# Altium project DesChal1.PrjPCB
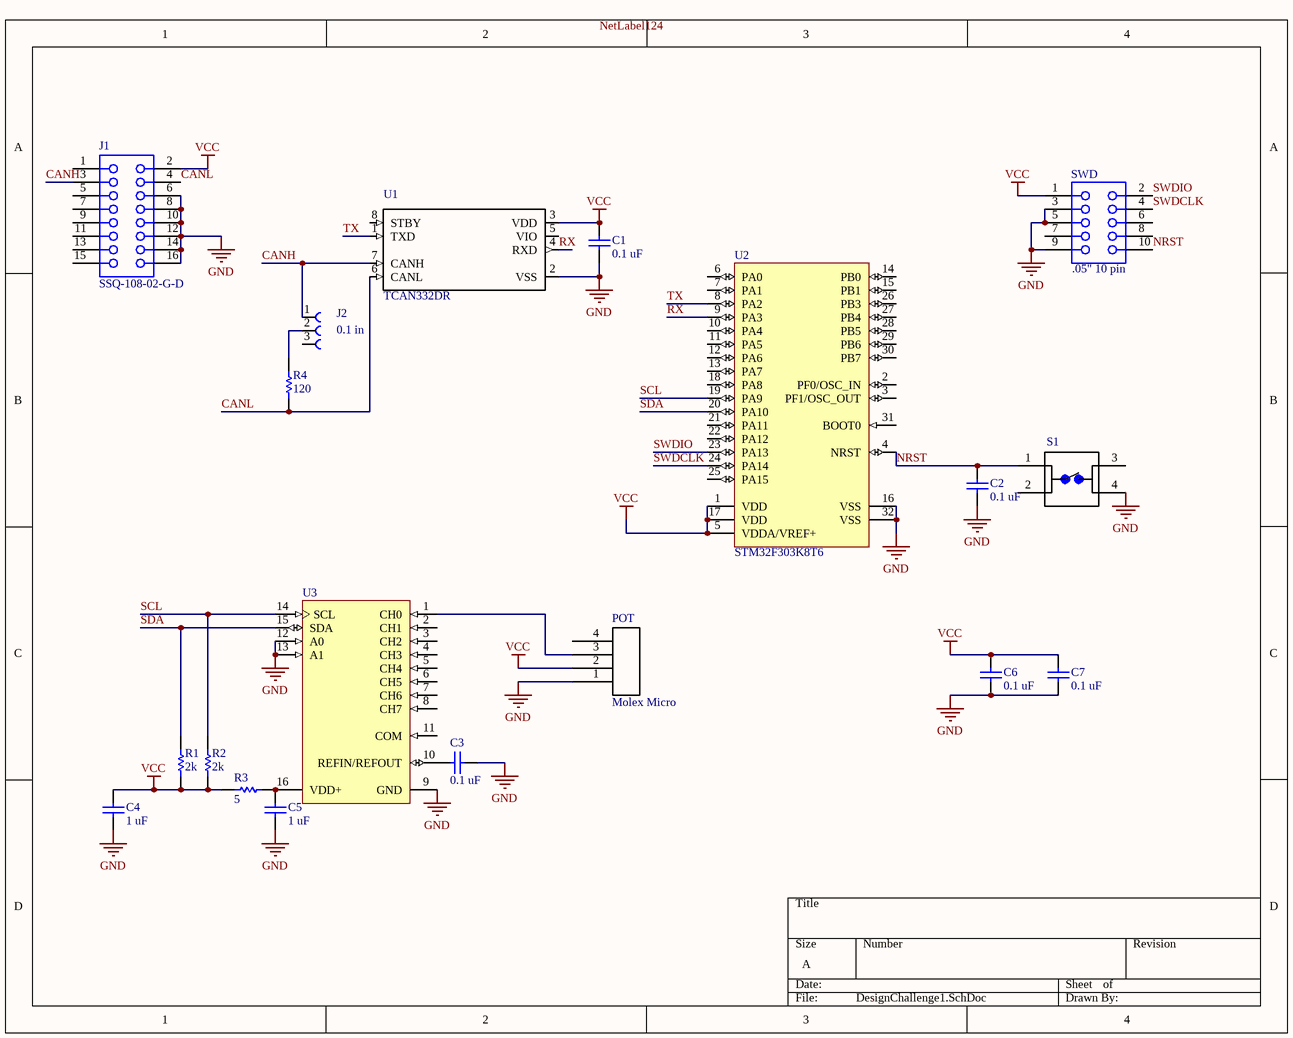
[diagram p0: DesignChallenge1.SchDoc]
1 sheet, 19 parts. Net scope: global (net labels, ports and power ports of the same name join across sheets).

## Sheet DesignChallenge1.SchDoc
size A

### Parts
C1  0.1 uF  [CAPC0805(2012)145_N]
C2  0.1 uF  [CAPC0805(2012)145_N]
C3  0.1 uF  [CAPC0805(2012)145_N]
C4  1 uF  [CAPC0805(2012)145_N]
C5  1 uF  [CAPC0805(2012)145_N]
C6  0.1 uF  [CAPC0805(2012)145_N]
C7  0.1 uF  [CAPC0805(2012)145_N]
J1  SSQ-108-02-G-D  [SMTC-SSQ-108-02-X-D]
J2  0.1 in  [61300311121]
POT  Molex Micro  [0430450427]
R1  2k  [RESC0805(2012)_N]
R2  2k  [RESC0805(2012)_N]
R3  5  [RESC0805(2012)_N]
R4  120  [RESC0805(2012)_N]
S1  1825910-7  [*SW_1825910-7]  (value not drawn)
SWD  .05" 10 pin  [PCE-FH127H432-10-SNGRH-2.4]
U1  TCAN332DR  [Model Name]
U2  STM32F303K8T6  [STM-LQFP32_M]
U3  (no value)  [TI-PW16_M]

### Nets
GND: C1.1 C2.1 C3.2 C4.1 C5.1 C6.1 C7.1 J1.6 J1.8 J1.10 J1.12 J1.14 J1.16 POT.1 S1.4 SWD.3 SWD.5 SWD.9 U1.2(VSS) U2.16(VSS) U2.32(VSS) U3.9(GND) U3.12(A0) U3.13(A1)
VCC: C1.2 C4.2 C6.2 C7.2 J1.2 POT.2 R1.2 R2.2 R3.2 SWD.1 U1.3(VDD) U2.1(VDD) U2.5(VDDA/VREF+) U2.17(VDD)
CANH: J1.3 J2.1 U1.7(CANH)
CANL: J1.4 R4.2 U1.6(CANL)
NRST: C2.2 S1.1 SWD.10 U2.4(NRST)
RX: U1.4(RXD) U2.9(PA3)
SCL: R2.1 U2.19(PA9) U3.14(SCL)
SDA: R1.1 U2.20(PA10) U3.15(SDA)
SWDCLK: SWD.4 U2.24(PA14)
SWDIO: SWD.2 U2.23(PA13)
TX: U1.1(TXD) U2.8(PA2)
NetC3_1: C3.1 U3.10(REFIN/REFOUT)
NetC5_2: C5.2 R3.1 U3.16(VDD+)
NetJ2_2: J2.2 R4.1
NetPOT_3: POT.3 U3.1(CH0)

Not connected (* = marked no-connect by the designer): J1 1 5 7 9 11 13 15; J2 3; POT 4; S1 2 3; SWD 6 7 8; U1 5(VIO) 8(STBY); U2 2(PF0/OSC_IN) 3(PF1/OSC_OUT) 6(PA0) 7(PA1) 10(PA4) 11(PA5) 12(PA6) 13(PA7) 14(PB0) 15(PB1) 18(PA8) 21(PA11) 22(PA12) 25(PA15) 26(PB3) 27(PB4) 28(PB5) 29(PB6) 30(PB7) 31(BOOT0); U3 2(CH1) 3(CH2) 4(CH3) 5(CH4) 6(CH5) 7(CH6) 8(CH7) 11(COM)

### Notes on the sheet
- Labels drawn without touching a wire or pin: NetLabel124

### Library data of the parts
C1-C7 = CMP-1036-02677-1: CAP 470pF 100V ±2% 0805 (2012 Metric) Thickness 1.45mm SMD; Tolerance: Â±2%; Case-Metric: 2012; Case-EIA: 0805; Technology: SMT; Rated Voltage: 100 V; Value: 470pF; Max Thickness: 1.45 mm
J1 = CMP-1023-00300-1: SQ Post Socket, Through-hole, Vertical, -55 to 125 degC, 2.54 mm Pitch, 16-Pin, Female, RoHS; Manufacturer: Samtec; Pitch: 2.54 mm; ComponentLink2URL: http://www.samtec.com/documents/webfiles/pdf/SSQ_TH.PDF; ComponentLink3Description: Package Specification; Mounting Technology: Through-hole; RoHS: True; PackageReference: SSQ-108-02-X-D; PartNumber: SSQ-108-02-G-D; Orientation: Vertical; ComponentLink1URL: http://www.samtec.com; DatasheetVersion: F-214; Temperature Range: -55 to 125 degC; PackageDescription: Assembly, Socket Strip .025[0.64] SQ Tail; PackageVersion: BD, 6/1987; ComponentLink2Description: Datasheet; ComponentLink1Description: Manufacturer URL; ComponentLink3URL: http://www.samtec.com/documents/webfiles/cpdf/SSQ-1XX-XX-XXX-X-XX-XXX-XX-X-MKT.pdf
J2 = 61300311121: Board-To-Board Connector, Vertical, WR-PHD Series, Through Hole, Header, 3, 2.54 mm; MF: Wurth Electronics; Package: None; MP: 61300311121; SnapEDA_Link: https://www.snapeda.com/parts/61300311121/Wurth%20Electronics%20Inc./view-part/?ref=snap; Availability: Unavailable; Price: None; Value: *
POT = Molex micro-fit 4-pin (Single row schematic): Molex micro-fit 3.0 dual row header. P/N 0430450427
R1-R4 = CMP-1013-00418-1: 160R 0.125W 1% 0805 (2012 Metric)  SMD; Case-Metric: 2012; Case-EIA: 0805; Value: 160.00 Ohm; Technology: SMT; Tolerance: 1 %; Power: 0.125 W
S1 = 1825910-7: FSM4JAH=6MM TACT SWITCH, HIGH TEMP; Contact_Current_Rating: 50 mA; MF: TE Connectivity; Configuration_Pole-Throw: Single Pole - Single Throw; Package: None; Price: None; MP: 1825910-7; EU_RoHS_Compliance: Compliant; SnapEDA_Link: https://www.snapeda.com/parts/1825910-7/TE%20Connectivity%20ALCOSWITCH%20Switches/view-part/?ref=snap; Availability: Unavailable; TE_purchase_URL: https://www.te.com/usa-en/product-1825910-7.html?te_bu=Cor&te_type=disp&te_campaign=seda_glo_cor-seda-global-disp-prtnr-fy19-seda-model-bom-cta_sma-317_1&elqCampaignId=32493; Value: *
SWD = CMP-0594-00001-1: Female Header, Pitch 1.27 mm, 2x5 Position, Height 4.3 mm, Tail Length 2.4 mm; PartNumber: FH127H432-10-SNGRH-2.4; Manufacturer: Pinchao Electronic; Insulator resistance (Min.): 5000 Megohms; No. of Rows: 2; Insulator Material: NY-6T; No. of positions: 10; Dielectric Withstaanding: AC 500 V; Current Rating: 2 Amps; Pitch: 1.27 mm; Plating: Gold Flash; ComponentLink1URL: http://www.suzhoupinchao.com/; PackageDescription: Female Header, Pitch 1.27 mm, 2x5 Position, Height 4.3 mm, Tail Length 2.4 mm; ComponentLink1Description: Manufacturer URL; Connector Type: Female Header; Mounting Technology: Through Hole; PackageReference: FH127H432-10-SNGRH-2.4; Operating Temperature: -40 to 105 degC
U1 = CAN Tranceiver: Microchip MCP2562-E/SN, CAN Transceiver 1MBps 1-channel IEC 61000-4-2, 8-Pin SOIC; Price: None; MF: Microchip; SnapEDA_Link: https://www.snapeda.com/parts/MCP2562-E/SN/Microchip/view-part/?ref=snap; MP: MCP2562-E/SN; Availability: Unavailable; Package: SO-8 Microchip; Value: *
U2 = CMP-0537-00040-1: ARM Cortex-M4 32-bit MCU, 64 KB Flash, 16 KB Internal RAM, 25 I/Os, 32-Pin LQFP, -40 to 85 degC, Tray; Supply Voltage(Vcc) min (V): 2; Internal RAM Size (kB): 16; D/A Converter: 3; FLASH Size (Prog) (kB): 64; I/Os (High Current): 25; Operating Frequency(F) (Processor speed) (MHz): 72; ComponentLink1URL: http://www.st.com/; Package Description: 32-Pin Low Profile Quad Flat Package, 7 x 7 mm Body, 0.8 mm Pitch; Mounting Technology: Surface Mount; ComponentLink2Description: Datasheet; ComponentLink2URL: http://www.st.com/st-web-ui/static/active/en/resource/technical/document/datasheet/DM00092070.pdf; Core: ARM Cortex-M4; ComponentLink1Description: Manufacturer URL; Package Reference: LQFP32; Packing: Tray; DatasheetVersion: Rev. 4
U3 = CMP-0003-00799-1: 12-Bit 50 kSPS ADC I2C Low Power 8-Channel Multiplexer Internal 2.5 V Reference, -40 to 85 degC, 16-pin SOP (PW16), Green (RoHS & no Sb/Br); Manufacturer: Texas Instruments; PartNumber: ADS7828EB/250; Interface: Serial I2C; # Input Channels: 8; Analog Voltage AV/DD(Min)(V): 2.7; SFDR(dB): 86; Digital Supply(Max)(V): 5.25; SNR(dB): 72; Sample Rate (max)(SPS): 50k; SubFamily: Precision ADC (<=10MSPS); INL(Max)(+/-LSB): 1; SINAD(dB): 71; Resolution(Bits): 12; Architecture: SAR; DatasheetVersion: SBAS181C; ComponentLink1Description: Manufacturer URL; ComponentLink1URL: http://www.ti.com/; ComponentLink3URL: http://www.ti.com/lit/ml/mpds361/mpds361.pdf; ComponentLink3Description: Package Specification; Code_JEDEC: MO-153; Analog Voltage AV/DD(Max)(V): 5.25; PackageVersion: 4040064-4/G, 02/2011; Mounting Technology: Surface Mount; ComponentLink2URL: http://www.ti.com/general/docs/lit/getliterature.tsp?genericPartNumber=ADS7828&fileType=pdf; PackageReference: PW16; Digital Supply(Min)(V): 2.7; PackageDescription: 16-Pin Plastic Small Outline, Body 5 x 4.4 mm, Pitch 0.65 mm; ComponentLink2Description: Datasheet; Eco-Plan: Green (RoHS & no Sb/Br); ComponentLink4Description: Better Datasheet; ComponentLink4URL: http://www.ti.com/lit/ds/symlink/ads7828-q1.pdf